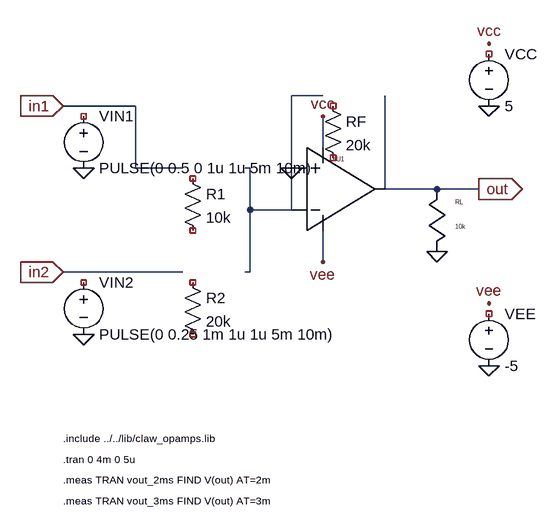
[diagram p0: schematic opamp_summing.asc]
opamp_summing.asc, the LTspice schematic file:
Version 4
SHEET 1 1200 935
WIRE 64 144 176 144
WIRE 176 144 176 240
WIRE 176 240 248 240
WIRE 64 400 248 400
WIRE 344 240 352 240
WIRE 344 400 352 400
WIRE 352 240 352 304
WIRE 352 400 352 304
WIRE 352 304 416 304
WIRE 416 304 416 128
WIRE 416 128 464 128
WIRE 560 128 560 272
WIRE 560 272 704 272
WIRE 464 208 464 160
WIRE 464 336 464 384
SYMBOL voltage 96 144 R0
SYMATTR InstName VIN1
SYMATTR Value PULSE(0 0.5 0 1u 1u 5m 10m)
SYMBOL voltage 96 400 R0
SYMATTR InstName VIN2
SYMATTR Value PULSE(0 0.25 1m 1u 1u 5m 10m)
SYMBOL voltage 720 48 R0
SYMATTR InstName VCC
SYMATTR Value 5
SYMBOL voltage 720 448 R0
SYMATTR InstName VEE
SYMATTR Value -5
SYMBOL res 248 240 R0
SYMATTR InstName R1
SYMATTR Value 10k
SYMBOL res 248 400 R0
SYMATTR InstName R2
SYMATTR Value 20k
SYMBOL res 464 128 R0
SYMATTR InstName RF
SYMATTR Value 20k
SYMBOL opamp2 416 208 R0
SYMATTR InstName XU1
SYMATTR Value CLAW_IDEAL_OPAMP
SYMBOL res_v 640 272 R0
SYMATTR InstName RL
SYMATTR Value 10k
FLAG 64 144 in1
IOPIN 64 144 In
FLAG 64 400 in2
IOPIN 64 400 In
FLAG 704 272 out
IOPIN 704 272 Out
FLAG 96 240 0
FLAG 96 496 0
FLAG 416 240 0
FLAG 640 368 0
FLAG 720 48 vcc
FLAG 720 144 0
FLAG 720 448 vee
FLAG 720 544 0
FLAG 464 160 vcc
FLAG 464 384 vee
TEXT 64 656 Left 1 !.include ../../lib/claw_opamps.lib
TEXT 64 688 Left 1 !.tran 0 4m 0 5u
TEXT 64 720 Left 1 !.meas TRAN vout_2ms FIND V(out) AT=2m
TEXT 64 752 Left 1 !.meas TRAN vout_3ms FIND V(out) AT=3m

The netlist it stands for:
* opamp_summing.asc
VIN1 NC_01 0 PULSE(0 0.5 0 1u 1u 5m 10m)
VIN2 NC_02 0 PULSE(0 0.25 1m 1u 1u 5m 10m)
VCC NC_03 0 5
VEE NC_04 0 -5
R1 NC_05 NC_06 10k
R2 NC_07 NC_08 20k
RF NC_09 NC_10 20k
XXU1 CLAW_IDEAL_OPAMP CLAW_IDEAL_OPAMP
RL out 0 10k
.include ../../lib/claw_opamps.lib
.tran 0 4m 0 5u
.meas TRAN vout_2ms FIND V(out) AT=2m
.meas TRAN vout_3ms FIND V(out) AT=3m
.backanno
.end